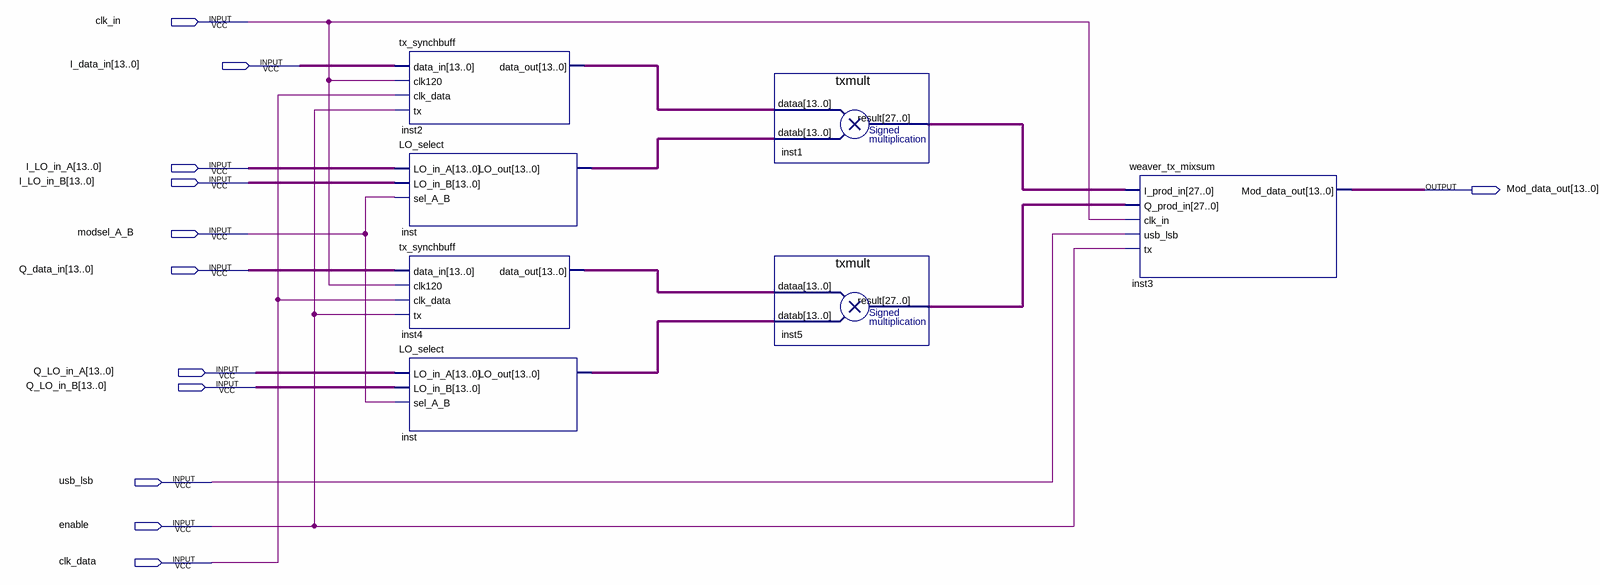
[diagram p0: schematic sheet]
// Quartus schematic weaver_tx_mult.bdf as structural Verilog: 7 symbols, 12 pins
module weaver_tx_mult (
  input  clk_in,
  input  [13:0] I_data_in,
  input  [13:0] I_LO_in_A,
  input  [13:0] I_LO_in_B,
  input  modsel_A_B,
  input  [13:0] Q_data_in,
  input  [13:0] Q_LO_in_A,
  input  [13:0] Q_LO_in_B,
  input  usb_lsb,
  input  enable,
  input  clk_data,
  output [13:0] Mod_data_out
);

  wire [13:0] inst2_data_out, inst4_data_out, inst_lo_out, inst_lo_out_2;
  wire [27:0] inst1_result, inst5_result;

  tx_synchbuff inst2 (
    .data_in(I_data_in), .clk120(clk_in), .clk_data(clk_data), .tx(enable), .data_out(inst2_data_out));
  LO_select inst (.LO_in_A(I_LO_in_A), .LO_in_B(I_LO_in_B), .sel_A_B(modsel_A_B), .LO_out(inst_lo_out_2));
  tx_synchbuff inst4 (
    .data_in(Q_data_in), .clk120(clk_in), .clk_data(clk_data), .tx(enable), .data_out(inst4_data_out));
  LO_select inst_dup2 (.LO_in_A(Q_LO_in_A), .LO_in_B(Q_LO_in_B), .sel_A_B(modsel_A_B), .LO_out(inst_lo_out));
  txmult inst1 (.dataa(inst2_data_out), .datab(inst_lo_out_2), .result(inst1_result));
  txmult inst5 (.dataa(inst4_data_out), .datab(inst_lo_out), .result(inst5_result));
  weaver_tx_mixsum inst3 (
    .I_prod_in(inst1_result), .Q_prod_in(inst5_result), .clk_in(clk_in), .usb_lsb(usb_lsb), .tx(enable),
    .Mod_data_out(Mod_data_out));
endmodule
